# Altium schematic sheet 2v5_Regulator.SchDoc: 2.5V ADC Regulator
size A4; Organization: Altium Limited; Address1: L3, 12a Rodborough Rd; Address2: Frenchs Forest; Address3: NSW; Address4: Australia 2086
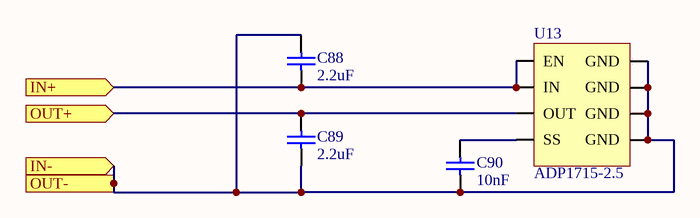
[diagram p0: 2v5_Regulator.SchDoc]

## Parts
C88  2.2uF  [0402_Cap]
C89  2.2uF  [0402_Cap]
C90  10nF  [0402_Cap]
U13  ADP1715-2.5  [MSOP_8]

## Ports
IN+ (in), IN- (in), OUT+ (in), OUT- (in)

## Nets
IN+: C88.1 U13.1(EN) U13.2(IN) ; port IN+
IN-: C88.2 C89.1 C90.1 U13.5(GND) U13.6(GND) U13.7(GND) U13.8(GND) ; port OUT-, port IN-
OUT+: C89.2 U13.3(OUT) ; port OUT+
NetC90_2: C90.2 U13.4(SS)

## Notes on the sheet
- Title
- Date:
- RE:
- Arturo di Girolamo
- Size:
- A3
- A

## Library data of the parts
C88 C89 = CL21A225KAFNNNE: Capacitor, 2.2uF, 0805; Value: .01uf; ASYPN: CL05A225KP5NNNC; MFGPN: CL21A225KAFNNNE
C90 = C0805C103K1RAC7210: Capacitor, 10nF, 0805; Value: .01uf; ASYPN: 0402B103K6R3CT; MFGPN: C0805C103K1RAC7210
U13 = ADP1715ARMZ-2.5-R7: 2.5V linear regulator; MFGPN: ADP1715ARMZ-2.5-R7; ASYPN: ADP1715ARMZ-2.5-R7